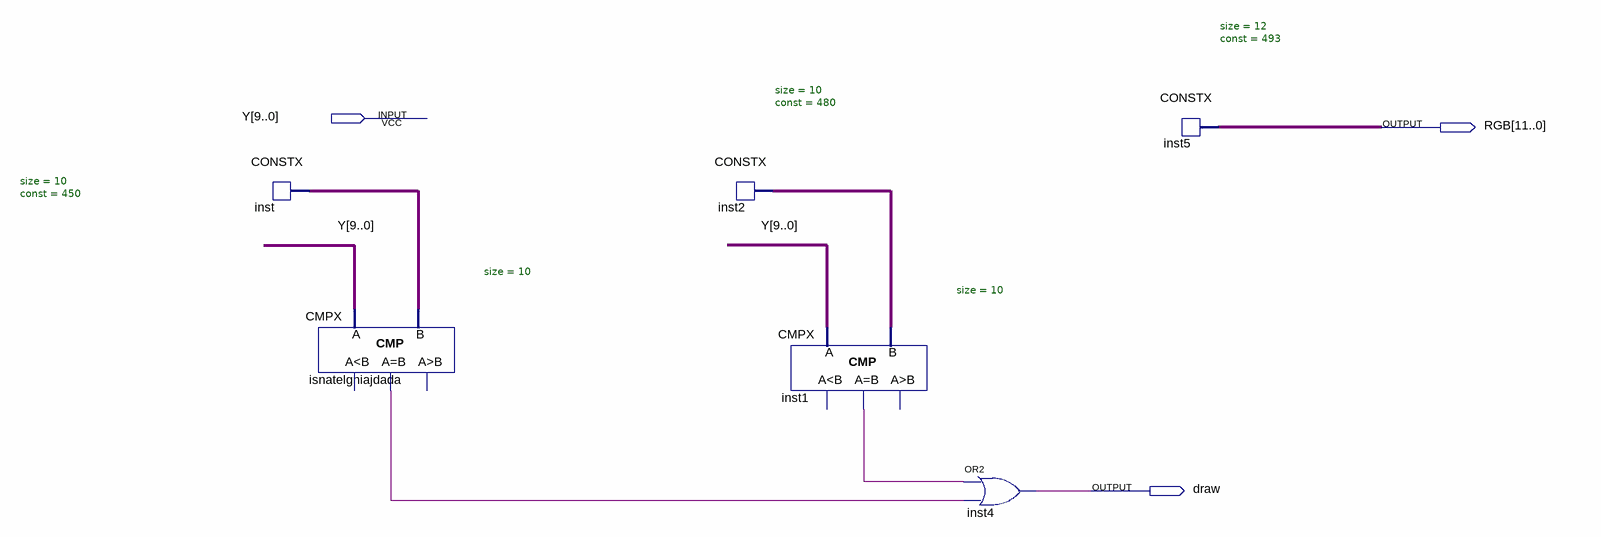
[diagram p0: schematic sheet]
// Quartus schematic dveLajne.bdf as structural Verilog: 6 symbols, 3 pins
module dveLajne (
  input  [9:0] Y,
  output [11:0] RGB,
  output draw
);

  wire inst1_eq, isnatelgniajdada_eq;
  wire [9:0] inst2_data, inst_data;

  CONSTX #(.size(10), .\const (450)) inst (.data(inst_data));
  CMPX #(.size(10)) isnatelgniajdada (.A(Y), .B(inst_data), .eq(isnatelgniajdada_eq));  // open: ls, gr
  CONSTX #(.size(10), .\const (480)) inst2 (.data(inst2_data));
  CMPX #(.size(10)) inst1 (.A(Y), .B(inst2_data), .eq(inst1_eq));  // open: ls, gr
  or inst4 (draw, inst1_eq, isnatelgniajdada_eq);
  CONSTX #(.size(12), .\const (493)) inst5 (.data(RGB));
endmodule
